# Altium schematic sheet THERMO.SchDoc: BMS
size A4; DrawnBy: Jarod Krane; SheetNumber: 6; SheetTotal: 8
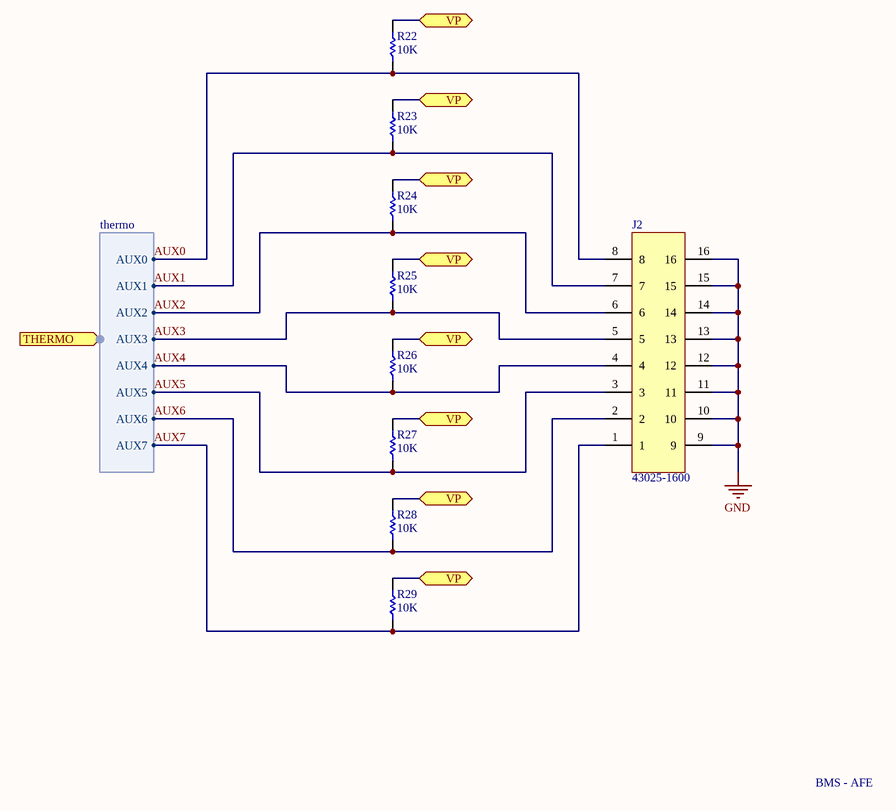
[diagram p0: THERMO.SchDoc]

## Parts
J2  43025-1600  [THERMO HDR]
R22  10K  [0603 RES]
R23  10K  [0603 RES]
R24  10K  [0603 RES]
R25  10K  [0603 RES]
R26  10K  [0603 RES]
R27  10K  [0603 RES]
R28  10K  [0603 RES]
R29  10K  [0603 RES]

## Ports
THERMO (harness thermo), VP

## Harnesses
thermo: AUX0, AUX1, AUX2, AUX3, AUX4, AUX5, AUX6, AUX7

## Nets
GND: J2.9 J2.10 J2.11 J2.12 J2.13 J2.14 J2.15 J2.16
AUX0: J2.8 R22.1 ; port THERMO.AUX0
AUX1: J2.7 R23.1 ; port THERMO.AUX1
AUX2: J2.6 R24.1 ; port THERMO.AUX2
AUX3: J2.5 R25.1 ; port THERMO.AUX3
AUX4: J2.4 R26.1 ; port THERMO.AUX4
AUX5: J2.3 R27.1 ; port THERMO.AUX5
AUX6: J2.2 R28.1 ; port THERMO.AUX6
AUX7: J2.1 R29.1 ; port THERMO.AUX7
VP: R22.2 R23.2 R24.2 R25.2 R26.2 R27.2 R28.2 R29.2 ; port VP

## Notes on the sheet
- BMS - AFE

## Library data of the parts
J2 = 43025-1600: CONN RECEPT 16POS 3MM DUAL ROW; Manufacturer: Molex; Number of Contacts: 16; Max Voltage Rating (DC): 600.6kV; Connector Type: Power,Rectangular,Socket; Max Voltage Rating (AC): 600V; Gender: Female; Current Rating: 5A; Contact Resistance: 10mR; Voltage Rating (AC): 250V; Approvals: CSA,TUV,UL; Glow Wire Compliant: Non-compliant; Supplier 1: Digi-Key; Manufacturer Part Number: 43025-1600; Stock 1: 21915; Pricing 1: 1=0.96, 10=0.843, 25=0.7928, 50=0.76, 100=0.7269, 250=0.6608, 500=0.5947, 1000=0.5286, 2500=0.4791 (USD); Mount: Cable; Colour: Black; Housing Colour: Black; Housing Material: Polyester; Material: Polyester; Min Operating Temperature: -40°C; Max Operating Temperature: 105°C; Orientation: Straight; Number of Rows: 2; Packaging: Bulk; Number of Positions: 16; Termination: Crimp; Package Quantity: 1500; Number of Poles: 16; Number of Circuits: 16; Working Voltage: 250V; Length: 24.85mm; Pitch: 3mm; Row Spacing: 3mm; Depth: 14mm; Width: 11.56mm; Radiation Hardening: No; Flammability Rating: UL94 V-0; REACH SVHC: Unknown; Lead Free: Lead Free; ComponentLink1URL: https://www.alliedelec.com/m/d/7b41ca9c4fb783ac9c05f4e8e707f04e.pdf; ComponentLink1Description: https://www.alliedelec.com/m/d/7b41ca9c4fb783ac9c05f4e8e707f04e.pdf; ComponentLink2URL: http://uk.rs-online.com/webdocs/13c3/0900766b813c3a12.pdf; ComponentLink2Description: http://uk.rs-online.com/webdocs/13c3/0900766b813c3a12.pdf; ComponentLink3URL: https://www.distrelec.biz/Web/Downloads/22/98/04402298.pdf?mime=application%2Fpdf; ComponentLink3Description: https://www.distrelec.biz/Web/Downloads/22/98/04402298.pdf?mime=application%2Fpdf; ComponentLink4URL: http://www.jameco.com/Jameco/Products/ProdDS/883000.pdf; ComponentLink4Description: http://www.jameco.com/Jameco/Products/ProdDS/883000.pdf; ComponentLink5URL: http://www.mouser.com/ds/2/276/0430251600_CRIMP_HOUSINGS-142756.pdf; ComponentLink5Description: http://www.mouser.com/ds/2/276/0430251600_CRIMP_HOUSINGS-142756.pdf; ComponentLink6URL: http://www.molex.com/webdocs/datasheets/pdf/en-us/0430251600_CRIMP_HOUSINGS.pdf; ComponentLink6Description: http://www.molex.com/webdocs/datasheets/pdf/en-us/0430251600_CRIMP_HOUSINGS.pdf; Supplier Part Number 1: WM2490-ND
R22-R29 = ERJ-3EKF1002V: RES SMD 10K OHM 1% 1/10W 0603; Manufacturer: Panasonic; Resistance: 10kR; Power Rating: 100mW; Voltage Rating: 75V; Temperature Coefficient: 100ppm/°C; Supplier 1: Digi-Key; Manufacturer Part Number: ERJ-3EKF1002V; Stock 1: 19944837; Pricing 1: 1=0.1, 10=0.064, 100=0.0261, 1000=0.0117, 2500=0.0102 (USD); Mount: Surface Mount; Case/Package: 0603; Number of Pins: 2; Case Code (Metric): 1608; Case Code (Imperial): 0603; Contact Plating: Tin; Min Operating Temperature: -55°C; Max Operating Temperature: 155°C; Tolerance: 1%; Packaging: Tape and Reel; Composition: Thick Film; Military Standard: Not; Voltage Rating (DC): 75V; Package Quantity: 1; Number of Terminations: 2; Termination: SMD/SMT; Max Power Dissipation: 100mW; Features: Automotive AEC-Q200; Length: 1.6mm; Height: 0.45mm; Width: 0.031inch; Depth: 0.8mm; Radiation Hardening: No; REACH SVHC: No SVHC; Lead Free: Lead Free; Supplier Part Number 1: P10.0KHDKR-ND